# EAGLE design can_rgx_led (EAGLE 9.4.2)
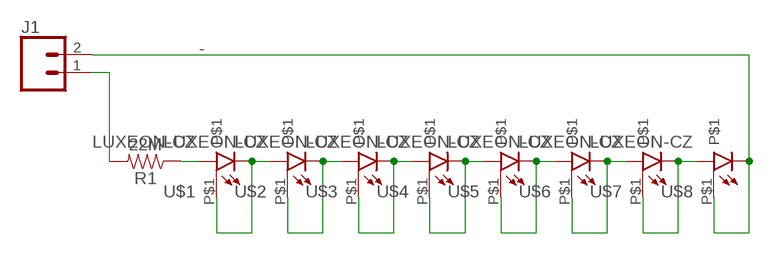
[diagram p0: schematic, sheet 1]

## Parts
J1  CONN_02  [1X02]
R1  22M  22MOHM-0603-1/10W-10%  [0603]
U$1  LUXEON-CZ  [LUXEON-CZ]
U$2  LUXEON-CZ  [LUXEON-CZ]
U$3  LUXEON-CZ  [LUXEON-CZ]
U$4  LUXEON-CZ  [LUXEON-CZ]
U$5  LUXEON-CZ  [LUXEON-CZ]
U$6  LUXEON-CZ  [LUXEON-CZ]
U$7  LUXEON-CZ  [LUXEON-CZ]
U$8  LUXEON-CZ  [LUXEON-CZ]

## Nets
+: J1.1 R1.2
-: J1.2 U$8.P$1 U$8.P$3(C)
N$1: U$3.P$1 U$3.P$3(C) U$4.P$2(A)
N$8: R1.1 U$1.P$2(A)
N$16: U$1.P$1 U$1.P$3(C) U$2.P$2(A)
N$17: U$2.P$1 U$2.P$3(C) U$3.P$2(A)
N$19: U$4.P$1 U$4.P$3(C) U$5.P$2(A)
N$20: U$5.P$1 U$5.P$3(C) U$6.P$2(A)
N$21: U$6.P$1 U$6.P$3(C) U$7.P$2(A)
N$22: U$7.P$1 U$7.P$3(C) U$8.P$2(A)

## Library data of the parts
J1 = SparkFun-Connectors:CONN_02: Multi connection point. Often used as Generic Header-pin footprint for 0.1 inch spaced/style header connections On any of the 0.1 inch spaced packages, you can populate with these: Break Away Headers - Straight <https://www.sparkfun.com/products/116> (PRT-00116) Break Away Male Headers - Right Angle <https://www.sparkfun.com/products/553> (PRT-00553) Female Headers <https://www.sparkfun.com/products/115> (PRT-00115) Break Away Headers - Machine Pin <https://www.sparkfun.com/products/117> (PRT-00117) Break Away Female Headers - Swiss Machine Pin <https://www.sparkfun.com/products/743> (PRT-00743) For SCREWTERMINALS and SPRING TERMINALS visit here: Screw Terimnals on SparkFun.com <https://www.sparkfun.com/search/results?term=Screw+Terminals> (5mm/3.5mm/2.54mm spacing) This device is also useful as a general connection point to wire up your design to another part of your project. Our various solder wires solder well into these plated through hole pads. Hook-Up Wire - Assortment (Stranded, 22 AWG) <https://www.sparkfun.com/products/11375> (PRT-11375) Hook-Up Wire - Assortment (Solid Core, 22 AWG) <https://www.sparkfun.com/products/11367> (PRT-11367) View the entire wire category on our website here <https://www.sparkfun.com/categories/141> Special notes: Molex polarized connector foot print use with: PRT-08233 with associated crimp pins and housings. 2.54_SCREWTERM for use with PRT-10571. 3.5mm Screw Terminal footprints for PRT-08084 5mm Screw Terminal footprints for use with PRT-08432
R1 = SparkFun-Resistors:22MOHM: 22MΩ resistor A resistor is a passive two-terminal electrical component that implements electrical resistance as a circuit element. Resistors act to reduce current flow, and, at the same time, act to lower voltage levels within circuits. - Wikipedia; PROD_ID: RES-11132
U$1-U$8 = uORocketry-parts:LUXEON-CZ

## Board
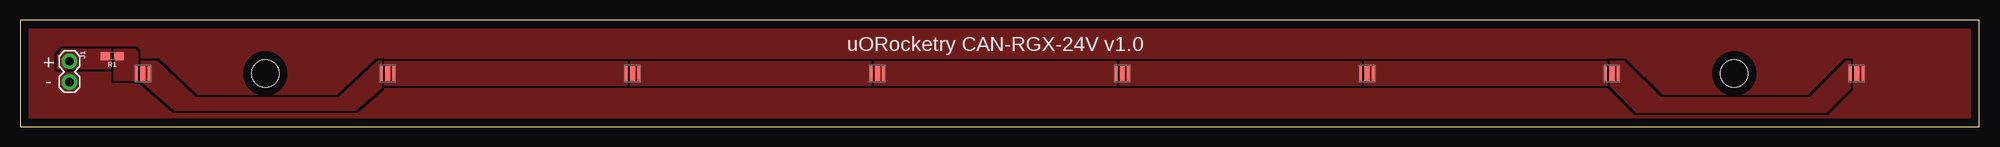
[diagram p1: board, top side]

Size 240 x 13 mm. Coordinates in mm from the lower left corner, seen from the top.
Outline: 0,0 240,0 240,13 0,13 0,0
Copper layers (1*16): Top 0.035mm / dielectric 1.5mm / Bottom 0.035mm
Design rules "default *": minimum track width 12mil, minimum drill 0.35mm, track to track 12mil, track to pad 12mil, pad to pad 12mil, via to via 12mil, smd to smd 12mil, copper to edge 40mil, drill to drill 6mil, minimum pad ring 10mil, minimum via ring 8mil, stop-mask expansion 4mil, vias tented up to drill 0mil, thermal gap 10mil
Holes 3.4 mm at 30,6.5 210,6.5
tKeepout: area 27.4,4 to 32.5,9.1; area 207.4,4 to 212.6,9.1

### Footprints (pad centres in the part's own frame; a part is rotated, then mirrored left to right if it is on the bottom)
1X02 = drill 1.016 pad 1.88: 1 0,0; 2 2.54,0
0603 = smd 1.1 x 1: 1 -0.85,0; 2 0.85,0
LUXEON-CZ = smd 0.6 x 1.8: P$1 0,0 | smd 0.3 x 1.8: P$2 -0.75,0; P$3 0.75,0

### Placement (x,y rotation side)
J1  6,8 270 top
R1  11.25,8.62 180 top
U$1  15,6.5 0 top
U$2  45,6.5 0 top
U$3  75,6.5 0 top
U$4  105,6.5 0 top
U$5  135,6.5 0 top
U$6  165,6.5 0 top
U$7  195,6.5 0 top
U$8  225,6.5 0 top

### Tracks (layer width: path | path; a pad name or v marks a point on that pad's centre or on a via)
+
  pour Top (rank 3, no thermals): 4.5,7 4.5,8.75 5.25,9.5 11.62,9.5 11.62,7
-
  pour Top (rank 6, no thermals): 0,13 0,0 240,0 240,13
N$1
  pour Top (no thermals): 74.75,8 104.25,8 104.25,5 74.75,5
N$8
  pour Top (rank 2, no thermals): 11.5,9.5 14,9.5 14.38,9.12 14.38,5.62 11.5,5.62
N$16
  pour Top (no thermals): 14.75,5.62 18.89,2 41.08,2 44.25,4.75 44.25,8 43.75,8 39,3.5 21.5,3.5 16.75,8 14.75,8
N$17
  pour Top (rank 2, no thermals): 44.38,8 74.5,8 74.5,5 44.38,5
N$19
  pour Top (rank 2, no thermals): 104.5,8 134.5,8 134.5,5 104.5,5
N$20
  pour Top (no thermals): 134.75,8 164.25,8 164.25,5 134.75,5
N$21
  pour Top (rank 2, no thermals): 164.25,8 194.62,8 194.62,5 164.25,5
N$22
  pour Top (no thermals): 194.75,5 198,1.75 221.25,1.75 224.25,4.75 224.25,8 223.75,8 219.25,3.5 201,3.5 196.5,8 194.75,8

### Text on the board
tSilk: uORocketry CAN-RGX-24V v1.0 | + | -